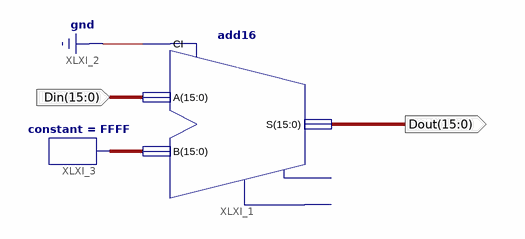
[diagram p0: schematic sheet 1]
// Xilinx ISE schematic dec.sch (spartan3e) as structural Verilog: 2 symbols, 2 ports
module dec (
  input  [15:0] Din,
  output [15:0] Dout
);

  wire [15:0] XLXN_4;

  add16 XLXI_1 (.A(Din), .B(XLXN_4), .CI(1'b0), .S(Dout));  // open: CO, OFL
  constant #(.CValue("FFFF")) XLXI_3 (.O(XLXN_4));
endmodule
